# Altium schematic sheet Power.SchDoc
size A; SheetNumber: 5; SheetTotal: 5
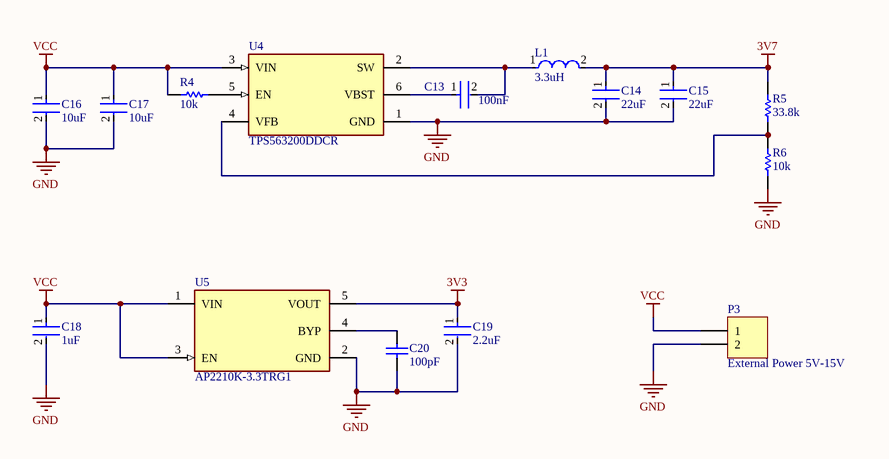
[diagram p0: Power.SchDoc]

## Parts
C13  100nF  [FP-CL21-IPC_C]
C14  22uF  [FP-CL21-IPC_A]
C15  22uF  [FP-CL21-IPC_A]
C16  10uF  [FP-CL21-IPC_B]
C17  10uF  [FP-CL21-IPC_B]
C18  1uF  [FP-CL21-IPC_C]
C19  2.2uF  [FP-GRM21B-0_15-IPC_A]
C20  100pF  [CAPC2013X145X48NL20T23]
L1  3.3uH  [FP-SRP4020TA-MFG]
P3  External Power 5V-15V  [HDR1X2]
R4  10k  [RESC2013X60X35NL10T20]
R5  33.8k  [RESC2013X60X35ML10T20]
R6  10k  [RESC2013X60X35NL10T20]
U4  TPS563200DDCR  [FP-DDC0006A-MFG]
U5  AP2210K-3.3TRG1  [FP-SOT25-MFG]

## Nets
3V3: C19.1 U5.5(VOUT)
3V7: C14.1 C15.1 L1.2 R5.2
GND: C14.2 C15.2 C16.2 C17.2 C18.2 C19.2 C20.1 P3.2 R6.1 U4.1(GND) U5.2(GND)
VCC: C16.1 C17.1 C18.1 P3.1 R4.1 U4.3(VIN) U5.1(VIN) U5.3(EN)
NetC13_1: C13.1 U4.6(VBST)
NetC13_2: C13.2 L1.1 U4.2(SW)
NetC20_2: C20.2 U5.4(BYP)
NetR4_2: R4.2 U4.5(EN)
NetR5_1: R5.1 R6.2 U4.4(VFB)

## Library data of the parts
C13 = CMP-2000-05017-2: CL21 Series 0805 100nF 50V ±10% Tolerance X7R Multilayer Ceramic Chip Capacitor; Depth: 1.25mm; Height: 0.85mm; Width: 0.049inch; Tolerance: 10%; Case Code (Metric): 2012; Case Code (Imperial): 0805; Material: Ceramic; Thickness: 0.037inch; Min Operating Temperature: -55°C; Contact Plating: Tin; Length: 2mm; Mount: Surface Mount; Voltage Rating (DC): 50V; Lead Free: Lead Free; Dielectric: X7R; Radiation Hardening: No; Capacitance: 100nF; Voltage Rating: 50V; Case/Package: 0805; Packaging: Tape and Reel; Max Operating Temperature: 125°C; Voltage: 50V
C14 C15 = CMP-13271-000185-1: CL21 Series 0805 22uF 6.3V ±20% Tolerance X5R Multilayer Ceramic Chip Capacitor; Height: 1.25mm; Length: 2mm; Capacitance: 22uF; Mount: Surface Mount; Dielectric: X5R; Voltage Rating (DC): 6.3V; Case Code (Metric): 2012; Depth: 1.25mm; Max Operating Temperature: 85°C; Voltage Rating: 6.3V; Width: 0.049inch; Case/Package: 0805; Radiation Hardening: No; Thickness: 0.055inch; Packaging: Tape and Reel; Package Quantity: 2000; Lead Free: Lead Free; Contact Plating: Tin; Min Operating Temperature: -55°C; Case Code (Imperial): 0805; Tolerance: 20%
C16 C17 = CMP-2000-06102-2: CL21 Series 0805 10uF 16V ±10% Tolerance X5R Multilayer Ceramic Chip Capacitor; Dielectric: X7R; Length: 2mm; Depth: 1.25mm; Voltage: 16V; Width: 0.049inch; Capacitance: 10uF; Lead Free: Lead Free; Max Operating Temperature: 85°C; Mount: Surface Mount; Voltage Rating: 16V; Height: 1.25mm; Radiation Hardening: No; Packaging: Tape and Reel; Voltage Rating (DC): 16V; Thickness: 0.055inch; Case/Package: 0805; Case Code (Imperial): 0805; Min Operating Temperature: -55°C; Case Code (Metric): 2012; Package Quantity: 1; Tolerance: 10%
C18 = CMP-13271-004196-1: CL21 Series 0805 1uF 50V ±10% Tolerance X7R Multilayer Ceramic Chip Capacitor; Tolerance: 10%; Thickness: 0.053inch; Case/Package: 0805; Mount: Surface Mount; Depth: 1.25mm; Radiation Hardening: No; Voltage Rating: 50V; Max Operating Temperature: 125°C; Case Code (Imperial): 0805; Min Operating Temperature: -55°C; Length: 0.079inch; Dielectric: X7R; Case Code (Metric): 2012; Packaging: Tape and Reel; Width: 0.049inch; Package Quantity: 1; Capacitance: 1uF; Height: 1.25mm
C19 = CMP-06035-028354-1: Chip Multilayer Ceramic Capacitors for General Purpose, 0805, 2.2uF, X7R, 15%, 10%, 25V; Voltage Rating (DC): 25V; Thickness: 1.25mm; Dielectric: X7R; Tolerance: 10%; Length: 2mm; Width: 1.25mm; Capacitance: 2.2uF
C20 = CMP-2007-03018-1: Part Number: VJ0805A101JXGAT5Z; Manufacturer: Vitramon
L1 = CMP-07248-000008-1: FIXED IND 3.3UH 3.5A 76 MOHM SMD; Manufacturer: Bourns; Manufacturer Part Number: SRP4020TA-3R3M; Shielding: true; Test Frequency: 100kHz; Self Resonant Frequency: 40MHz; Saturation Current: 4A; Q Factor: 10; Series Resistance: 76mΩ; Automotive Grade: Grade 0; Core Material: Carbonyl Powder; Tolerance: 20%; Temperature Range High: +150°C; Height: 2.1mm; Temperature: -40°C to +150°C; RoHS: TRUE; Device Class L3: Fixed Inductors; Automotive: Yes; Octopart: https://octopart.com/srp4020ta-3r3m-bourns-47300338; Composition: Wirewound; Mouser Description: Ind Power Shielded Wirewound 3.3uH 20% 100KHz Carbonyl Powder 3.5A T/R; Category: Ind; ComponentLink2Description: Datasheet; ComponentLink2URL: https://www.bourns.com/docs/Product-Datasheets/SRP4020TA.pdf; Digikey Description: FIXED IND 3.3UH 3.5A 76 MOHM SMD; Lead Free: Yes; Temperature Range Low: -40°C; Inductance: 3.3uH; Rms Current: 3.5A; Package: SRP4020TA; Value: 3.3uH; Device Class L1: Passive Components; Device Class L2: Inductors
P3 = Header 2: Header, 2-Pin; LatestRevisionDate: 17-Jul-2002; LatestRevisionNote: Re-released for DXP Platform.; Publisher: Altium Limited
R4 R6 = CMP-1659-00013-4: Chip Resistor, 10 KOhm, +/- 1%, 0.125 W, -55 to 155 degC, 0805 (2012 Metric), RoHS, Tape and Reel; Manufacturer: Yageo; Voltage Rating: 150 V; Mount: Surface Mount; ComponentLink1Description: Manufacturer URL; ComponentLink2URL: http://www.yageo.com/documents/recent/PYu-RC_Group_51_RoHS_L_04.pdf; Pins: 2; Length: 2 mm; Min Operating Temperature: -55 degC; Height: 0.5 mm; Mounting Technology: Surface Mount; RoHSCompliant: true; REACH SVHC: No SVHC; ComponentLink1URL: http://www.yageo.com/; Max Operating Temperature: 155 degC; PackageReference: 0805; DatasheetVersion: Rev. 4, 02/2016; Package Quantity: 5000; Packaging: Tape and Reel; ComponentLink2Description: Datasheet; PackageDescription: 2-Pin Surface Mounted Device, Body 2 x 1.25 mm
R5 = CMP-2001-01109-1: Manufacturer: Yageo; Part Number: RC0805FR-0738K3L
U4 = CMP-04918-000155-1: IC REG BUCK ADJ 3A TSOT23-6; Quiescent Current: 190uA; Output Voltage: 7V; Min Input Voltage: 4.5V; Output Configuration: Positive; Number of Outputs: 1; Switching Frequency: 650kHz; Synchronous Rectifier: Yes; Min Output Voltage: 760mV; Output Type: Adjustable; Operating Supply Voltage: 17V; Max Operating Temperature: 125°C; Lead Free: Lead Free; Packaging: Tape and Reel; Radiation Hardening: No; Mount: Surface Mount; Contact Plating: Tin; Output Current: 3A; Max Output Voltage: 7V; Min Operating Temperature: -40°C; Case/Package: SOT-23-6; Max Output Current: 3A; Max Input Voltage: 17V
U5 = CMP-12756-000023-1: IC REG LINEAR 3.3V 300MA SOT23-5; Manufacturer: Diodes; Number Of Outputs: 1; Max Supply Voltage: 13.2V; Max Junction Temp: +125°C; Accuracy Percentage: 1%; Nominal Supply Current: 0.01uA; Output Type: Fixed; Min Supply Voltage: 2.5V; Dropout Voltage: 250mV; Standoff Height: 0.013mm; Temperature: -40°C to +85°C; Temperature Range High: +85°C; Device Class L3: Voltage Regulators - Linear; Package: SOT25; ComponentLink2Description: Datasheet; ComponentLink2URL: https://www.diodes.com/assets/Datasheets/AP2210.pdf; Digikey Description: IC REG LINEAR 3.3V 300MA SOT23-5; Height: 1.4mm; Lead Free: Yes; Footprint Url: https://www.diodes.com/assets/Package-Files/SOT25.pdf; Mouser Description: LDO Voltage Regulators 300mA CMOS LDO 3.3V 250mV; Output Current: 300mA; Output Voltage: 3.3V; Category: IC; Octopart: https://octopart.com/ap2210k-3.3trg1-diodes+inc.-30954630; RoHS: TRUE; Device Class L1: Integrated Circuits (ICs); Temperature Range Low: -40°C; Device Class L2: Power Management ICs; Automotive: No; Manufacturer Part Number: AP2210K-3.3TRG1